# Altium schematic sheet 00_Main_Design.SchDoc
size 420 x 297 mm; Author: Shpakov Dmitry; Address1: Address1; Address2: Address2; Address3: Address3; Address4: Address4; DocumentNumber: АБВГ.123456.001 Э3; SheetNumber: 1; SheetTotal: 13; Scale: 1:1; DocumentType: Схема электрическая принципиальная; FirstReferrence: АБВГ.123456.001
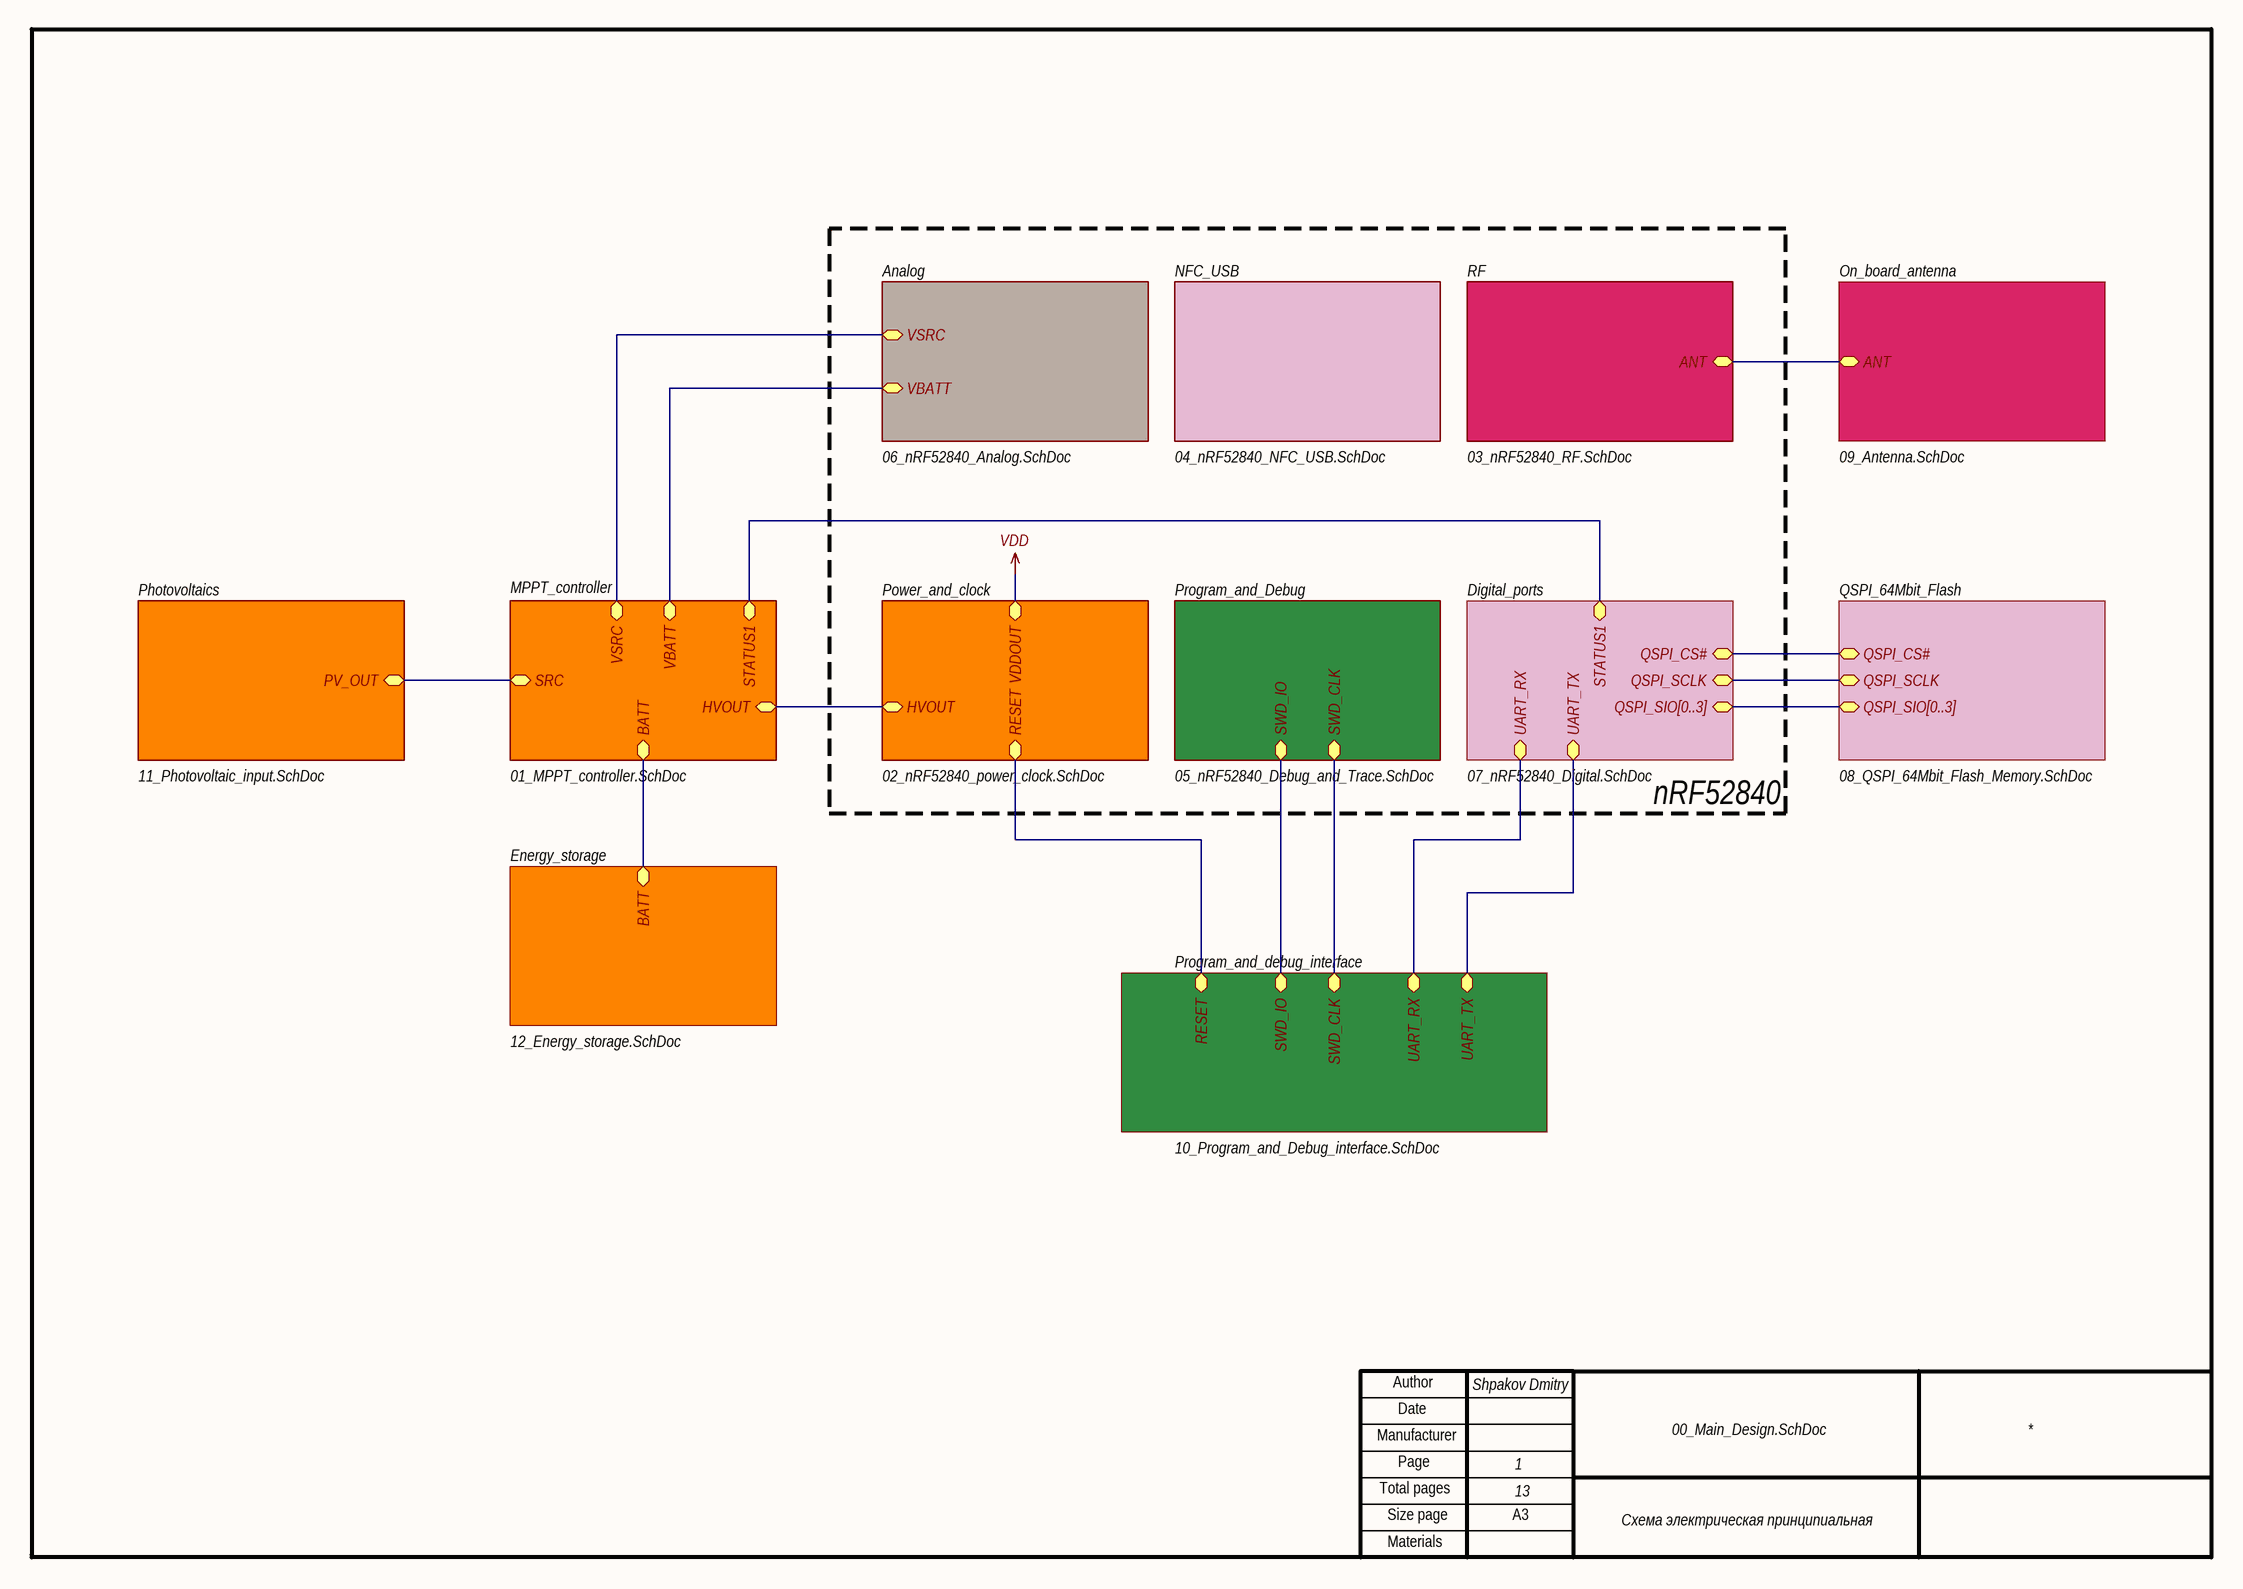
[diagram p0: 00_Main_Design.SchDoc]

## Sub-sheets
Analog = 06_nRF52840_Analog.SchDoc: VSRC, VBATT
Digital_ports = 07_nRF52840_Digital.SchDoc: UART_TX, UART_RX, STATUS1, QSPI_SIO[0..3], QSPI_SCLK, QSPI_CS#
Energy_storage = 12_Energy_storage.SchDoc: BATT
MPPT_controller = 01_MPPT_controller.SchDoc: STATUS1, HVOUT, VSRC, VBATT, SRC, BATT
NFC_USB = 04_nRF52840_NFC_USB.SchDoc: no entries
On_board_antenna = 09_Antenna.SchDoc: ANT
Photovoltaics = 11_Photovoltaic_input.SchDoc: PV_OUT
Power_and_clock = 02_nRF52840_power_clock.SchDoc: HVOUT, RESET, VDDOUT
Program_and_Debug = 05_nRF52840_Debug_and_Trace.SchDoc: SWD_CLK, SWD_IO
Program_and_debug_interface = 10_Program_and_Debug_interface.SchDoc: UART_RX, SWD_IO, UART_TX, RESET, SWD_CLK
QSPI_64Mbit_Flash = 08_QSPI_64Mbit_Flash_Memory.SchDoc: QSPI_SIO[0..3], QSPI_SCLK, QSPI_CS#
RF = 03_nRF52840_RF.SchDoc: ANT

## Nets
VDD: sheet Power_and_clock/VDDOUT
(unnamed): sheet MPPT_controller/STATUS1, sheet Digital_ports/STATUS1
(unnamed): sheet MPPT_controller/HVOUT, sheet Power_and_clock/HVOUT
(unnamed): sheet MPPT_controller/VSRC, sheet Analog/VSRC
(unnamed): sheet MPPT_controller/VBATT, sheet Analog/VBATT
(unnamed): sheet MPPT_controller/SRC, sheet Photovoltaics/PV_OUT
(unnamed): sheet MPPT_controller/BATT, sheet Energy_storage/BATT
(unnamed): sheet Power_and_clock/RESET, sheet Program_and_debug_interface/RESET
(unnamed): sheet RF/ANT, sheet On_board_antenna/ANT
(unnamed): sheet Digital_ports/UART_TX, sheet Program_and_debug_interface/UART_TX
(unnamed): sheet Digital_ports/UART_RX, sheet Program_and_debug_interface/UART_RX
(unnamed): sheet Digital_ports/QSPI_SCLK, sheet QSPI_64Mbit_Flash/QSPI_SCLK
(unnamed): sheet Digital_ports/QSPI_CS#, sheet QSPI_64Mbit_Flash/QSPI_CS#
(unnamed): sheet Program_and_Debug/SWD_CLK, sheet Program_and_debug_interface/SWD_CLK
(unnamed): sheet Program_and_Debug/SWD_IO, sheet Program_and_debug_interface/SWD_IO

## Buses and harness runs
bus sheet Digital_ports/QSPI_SIO[0..3] = sheet QSPI_64Mbit_Flash/QSPI_SIO[0..3]

## Notes on the sheet
- nRF52840
- Author
- Manufacturer
- Date
- Page
- Total pages
- Size page
- A3
- Materials